# Altium schematic sheet Etherent.SchDoc: Motor Monitoring
size A3; Organization: NTUST EE-305; Address1: No.43, Sec. 4, Keelung Rd.; Address2: Da’an Dist.; Address3: Taipei 106; Address4: Taiwan (R.O.C.); Revision: 2.0; SheetNumber: 2; SheetTotal: 4
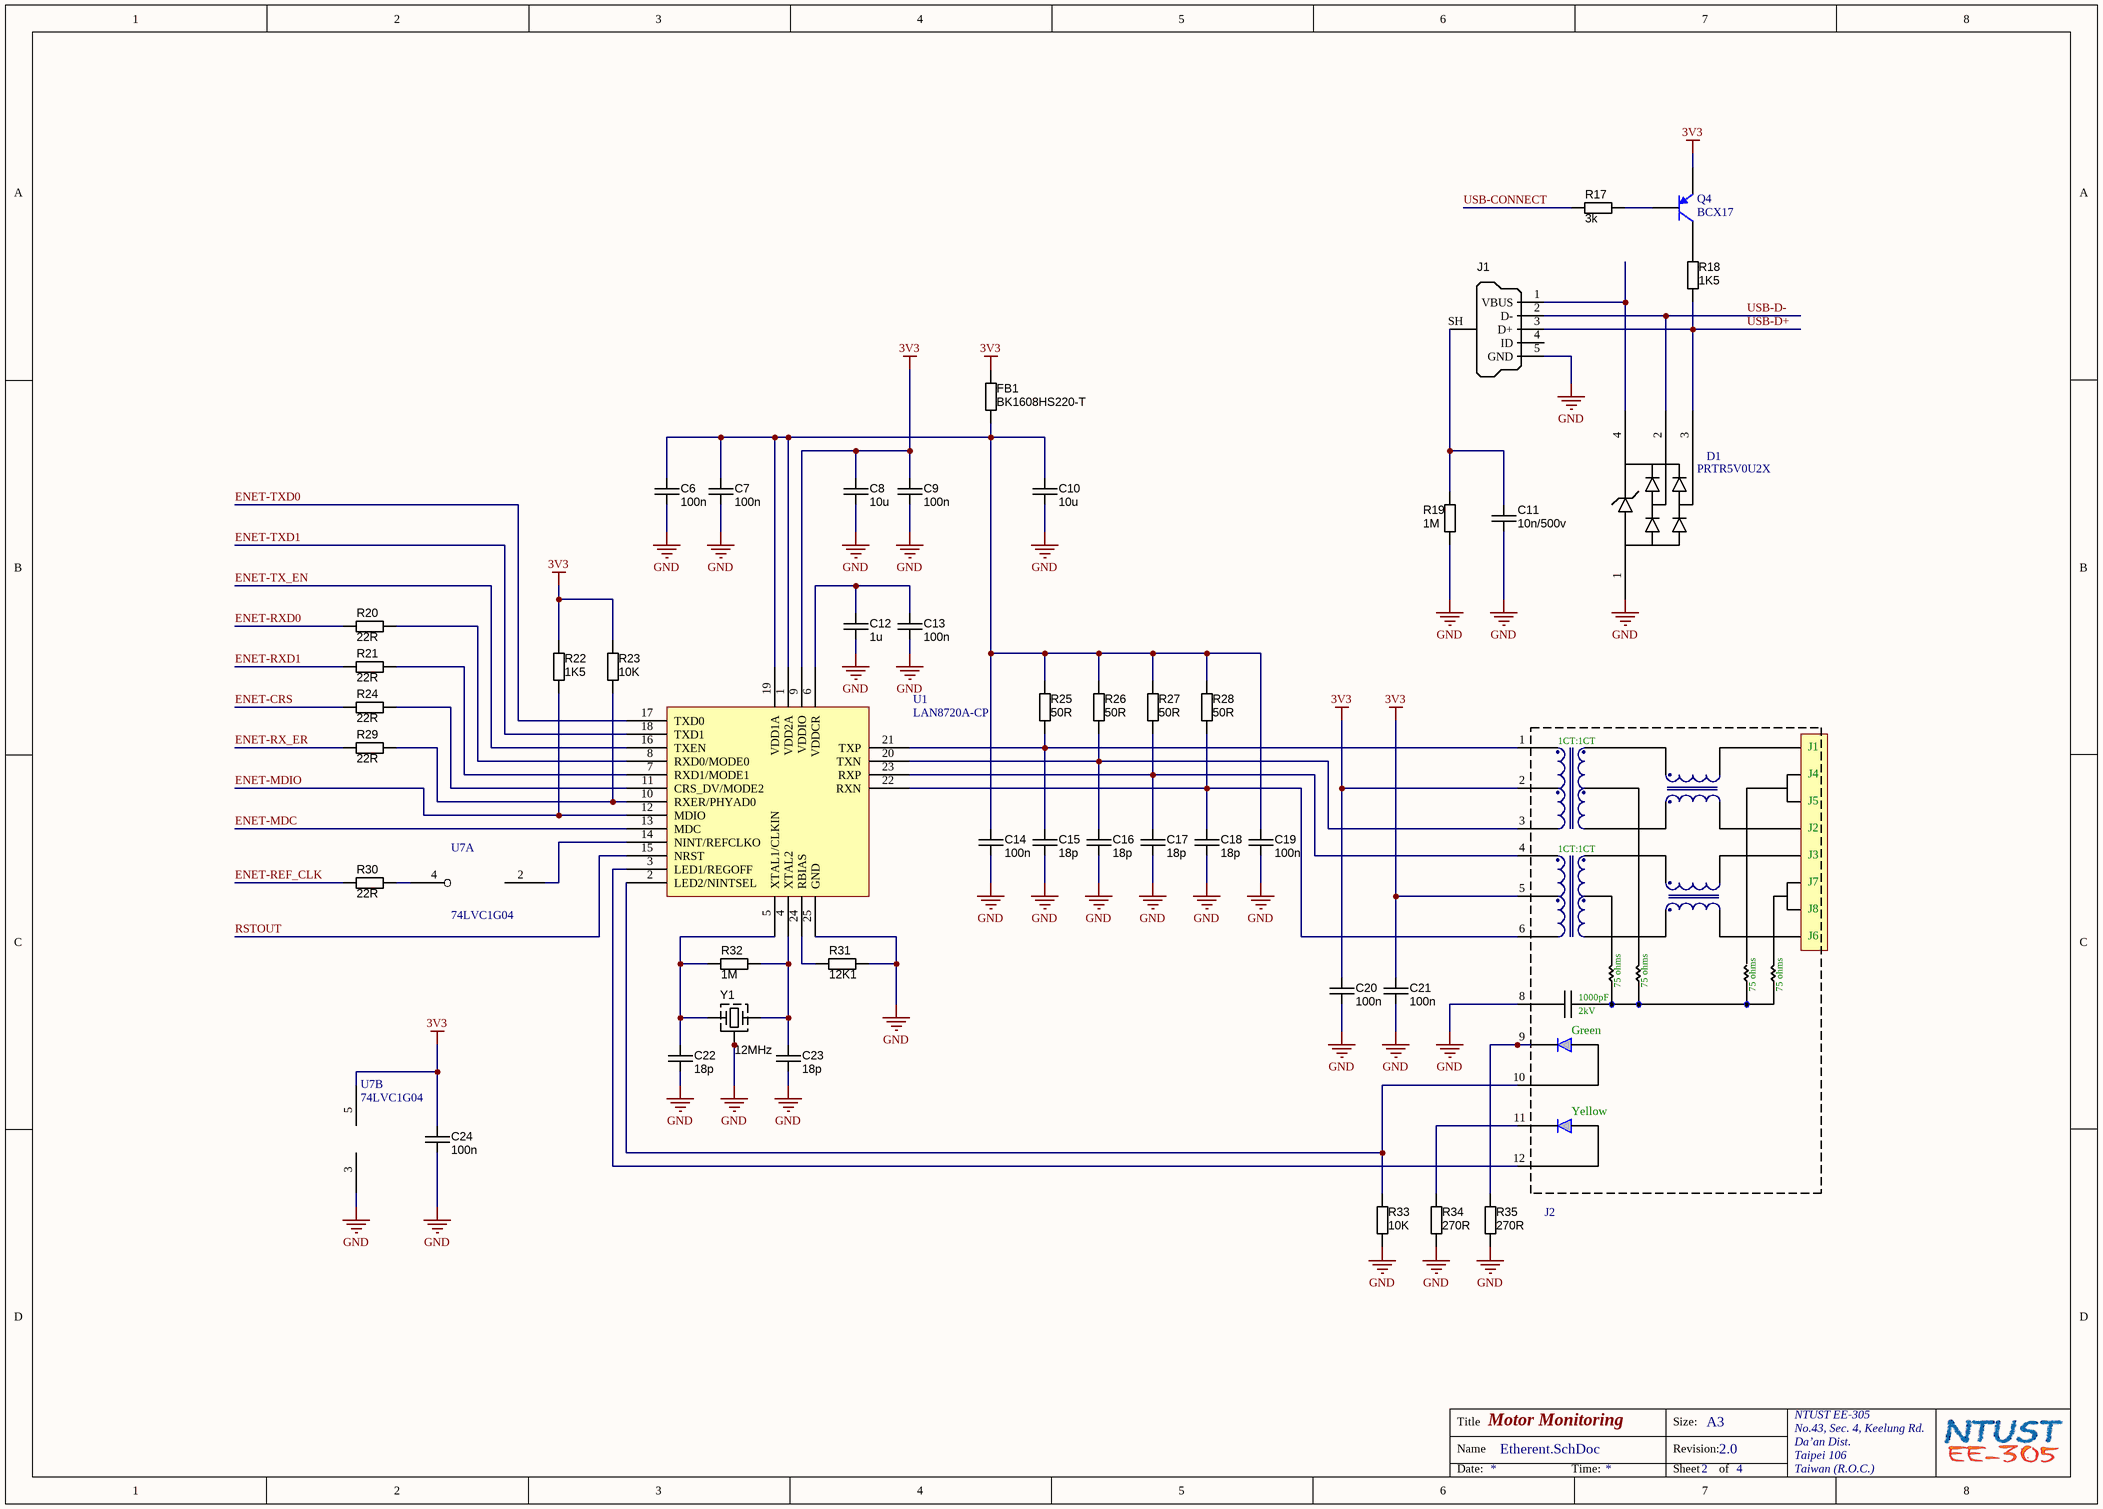
[diagram p0: Etherent.SchDoc]

## Parts
C6  value 100n  [CAPC1608N]  (hidden comment: approved sub OK)
C7  value 100n  [CAPC1608N]  (hidden comment: approved sub OK)
C8  value 10u  [CAPC1608N]  (hidden comment: approved sub OK)
C9  value 100n  [CAPC1608N]  (hidden comment: approved sub OK)
C10  value 10u  [CAPC3216N]  (hidden comment: approved sub OK)
C11  value 10n/500v  [CAPC1608N]  (hidden comment: approved sub OK)
C12  value 1u  [CAPC2012N]  (hidden comment: approved sub OK)
C13  value 100n  [CAPC1608N]  (hidden comment: approved sub OK)
C14  value 100n  [CAPC1608N]  (hidden comment: approved sub OK)
C15  value 18p  [CAPC1005N]  (hidden comment: approved sub OK)
C16  value 18p  [CAPC1005N]  (hidden comment: approved sub OK)
C17  value 18p  [CAPC1005N]  (hidden comment: approved sub OK)
C18  value 18p  [CAPC1005N]  (hidden comment: approved sub OK)
C19  value 100n  [CAPC1608N]  (hidden comment: approved sub OK)
C20  value 100n  [CAPC1608N]  (hidden comment: approved sub OK)
C21  value 100n  [CAPC1608N]  (hidden comment: approved sub OK)
C22  value 18p  [CAPC1005N]  (hidden comment: approved sub OK)
C23  value 18p  [CAPC1005N]  (hidden comment: approved sub OK)
C24  value 100n  [CAPC1608N]  (hidden comment: approved sub OK)
D1  PRTR5V0U2X  [SOT190P230X120-4N]
FB1  value BK1608HS220-T  [CAPC3216N]  (hidden comment: Thick Film)
J1  USB Micro Type B  [USB_Micro-B_FCI_SMD]  (value not drawn)
J2  (no value)  [ARJC01-111002T]
Q4  BCX17  [SOT23-3N]
R17  value 3k  [RESC1005N]  (hidden comment: Thick Film)
R18  value 1K5  [RESC1005N]  (hidden comment: Thick Film)
R19  value 1M  [RESC1005N]  (hidden comment: Thick Film)
R20  value 22R  [RESC1005N]  (hidden comment: Thick Film)
R21  value 22R  [RESC1005N]  (hidden comment: Thick Film)
R22  value 1K5  [RESC1005N]  (hidden comment: Thick Film)
R23  value 10K  [RESC1005N]  (hidden comment: Thick Film)
R24  value 22R  [RESC1005N]  (hidden comment: Thick Film)
R25  value 50R  [RESC1005N]  (hidden comment: Thick Film)
R26  value 50R  [RESC1005N]  (hidden comment: Thick Film)
R27  value 50R  [RESC1005N]  (hidden comment: Thick Film)
R28  value 50R  [RESC1005N]  (hidden comment: Thick Film)
R29  value 22R  [RESC1005N]  (hidden comment: Thick Film)
R30  value 22R  [RESC1005N]  (hidden comment: Thick Film)
R31  value 12K1  [RESC1005N]  (hidden comment: Thick Film)
R32  value 1M  [RESC1005N]  (hidden comment: Thick Film)
R33  value 10K  [RESC1005N]  (hidden comment: Thick Film)
R34  value 270R  [RESC1005N]  (hidden comment: Thick Film)
R35  value 270R  [RESC1005N]  (hidden comment: Thick Film)
U1  LAN8720A-CP  [QFN-MJ24]
U7  74LVC1G04  [SOT-23-CT5_N]  (parts A,B of 2)
Y1  12MHz  [CRYSTAL_4-LCC]

## Nets
3V3: C8.1 C9.1 C20.1 C21.1 C24.1 FB1.2 J2.2(CTD) J2.5(CRD) Q4.2(E) R22.1 R23.1 U1.9(VDDIO) U7.5(VCC)
GND: C6.2 C7.2 C8.2 C9.2 C10.2 C11.2 C12.2 C13.2 C14.1 C15.1 C16.1 C17.1 C18.1 C19.1 C20.2 C21.2 C22.1 C23.1 C24.2 D1.1(GND) J1.5(GND) J2.8(Shield) R19.1 R31.1 R33.2 R34.1 R35.1 U1.25(GND) U7.3(GND) Y1.2(GND) Y1.4(GND)
ENET-CRS: R24.1
ENET-MDC: U1.13(MDC)
ENET-MDIO: R22.2 U1.12(MDIO)
ENET-REF_CLK: R30.1
ENET-RX_ER: R29.2
ENET-RXD0: R20.1
ENET-RXD1: R21.1
ENET-TX_EN: U1.16(TXEN)
ENET-TXD0: U1.17(TXD0)
ENET-TXD1: U1.18(TXD1)
RSTOUT: U1.15(NRST)
USB-CONNECT: R17.2
USB-D+: D1.3(I/O_2) J1.3(D+) R18.2
USB-D-: D1.2(I/O_1) J1.2(D-)
NetC6_1: C6.1 C7.1 C10.1 C14.2 C19.2 FB1.1 R25.1 R26.1 R27.1 R28.1 U1.1(VDD2A) U1.19(VDD1A)
NetC11_1: C11.1 J1.SH(Shell) R19.2
NetC12_1: C12.1 C13.1 U1.6(VDDCR)
NetC15_2: C15.2 J2.1(TD+) R25.2 U1.21(TXP)
NetC16_2: C16.2 J2.3(TD-) R26.2 U1.20(TXN)
NetC17_2: C17.2 J2.4(RD+) R27.2 U1.23(RXP)
NetC18_2: C18.2 J2.6(RD-) R28.2 U1.22(RXN)
NetC22_2: C22.2 R32.1 U1.5(XTAL1/CLKIN) Y1.1(X)
NetC23_2: C23.2 R32.2 U1.4(XTAL2) Y1.3(X)
NetD1_4: D1.4(VCC) J1.1(VBUS)
NetJ2_9: J2.9 R35.2
NetJ2_10: J2.10 R33.1 U1.2(LED2/NINTSEL)
NetJ2_11: J2.11 R34.2
NetJ2_12: J2.12 U1.3(LED1/REGOFF)
NetQ4_1: Q4.1(B) R17.1
NetQ4_3: Q4.3(C) R18.1
NetR20_2: R20.2 U1.8(RXD0/MODE0)
NetR21_2: R21.2 U1.7(RXD1/MODE1)
NetR23_2: R23.2 R29.1 U1.10(RXER/PHYAD0)
NetR24_2: R24.2 U1.11(CRS_DV/MODE2)
NetR30_2: R30.2 U7.4
NetR31_2: R31.2 U1.24(RBIAS)
NetU1_14: U1.14(NINT/REFCLKO) U7.2

Not connected (* = marked no-connect by the designer): J1 4(ID)

## Notes on the sheet
- Title
- Name
- Size:
- Revision:
- A3
- Date:
- Time:
- Sheet
- of
- (in symbol ARJC01-111002T) 1CT:1CT; J1; J4; J5; J3; J7; J8; J6; 75 ohms; 1000pF; 2kV; Green; Yellow

## Library data of the parts
C6-C24 = CAPC_100n_0805: Capacitor SMD Cer 100nF 10% 50V X7R 0805; Manufacturer 1: Kemet; Manufacturer Part Number 1: C0805C104K5RACTU; Tolerance: ?0%; Ratings: 50V; X7R; Material: ceramic; Package / Case: 0805 (2012 metric); Supplier 1: Digi-Key; Supplier Part Number 1: 399-1170-1-ND
FB1 R17-R35 = RES_330R_0402_5%: Resistor SMD chip 330 Ohm 0.063W 5% 0402; Manufacturer 1: Yageo; Manufacturer Part Number 1: RC0402JR-07330RL; Ratings: 1/16 W; Tolerance: ?%; Package / Case: 0402 (1005 Metric); Supplier 1: Digi-Key; Supplier Part Number 1: 311-330JRCT-ND; ComponentLink1URL: http://www.yageo.com/documents/recent/PYu-RC0402_51_RoHS_L_6.pdf; ComponentLink1Description: http://www.yageo.com/documents/recent/PYu-RC0402_51_RoHS_L_6.pdf
J1 = USB_Micro_TypeB_FCI: Connector SMD-THD USB Micro Type B middle mount; Manufacturer 1: FCI; Manufacturer Part Number 1: 10103593-0001LF; Package / Case: SMD/THD mid-mount; Supplier 1: Digi-Key; Supplier Part Number 1: 609-4049-1-ND
J2 = ARJC01-111002T: 10/100 Base-Tx Tap Up RJ45 with LED
Q4 = BCX17: PNP General Purpose Transistors; Published: 8-Jun-2000; LatestRevisionDate: 15-Jan-2003; LatestRevisionNote: PCB Footprint 'BCY-W3/D4.7' replaced; DatasheetVersion: 1997; PackageVersion: Sep-1998; PackageReference: TO-92A; Publisher: Altium Limited; PackageDescription: TO, Flat Index; 3 In-Line, Axial Leads; Body Dia. 4.5mm; Leads 0.51 x 0.48 mm (max); ComponentLink1Description: Manufacturer Link; ComponentLink1URL: http://www.fairchildsemi.com/; ComponentLink2Description: Datasheet; ComponentLink2URL: http://www.fairchildsemi.com/ds/2N%2F2N3906.pdf
Y1 = CRYSTAL_27M12: Oscillator Crystal 27.12 MHz 10ppm; Manufacturer 1: TXC CORPORATION; Manufacturer Part Number 1: 7M-27.120MEEQ-T; Ratings: 4.9152 MHz Crystal; Frequency Stability: ?0ppm; Load Capacitance: 10pF; Operating Mode: Fundamental; Package / Case: 2.5mm pitch; Material: Ceramic; Supplier 1: Digi-Key; Supplier Part Number 1: 887-1329-1-ND; Type: MHz Crystal; Frequency Tolerance: ?0ppm; Operating Temperature: -20蚓 ~ 70蚓; Mounting Type: Surface Mount; Size / Dimension: 0.126" L x 0.098" W (3.20mm x 2.50mm); ComponentLink1URL: http://www.txccrystal.com/images/pdf/7m-accuracy.pdf; ComponentLink1Description: http://www.txccrystal.com/images/pdf/7m-accuracy.pdf